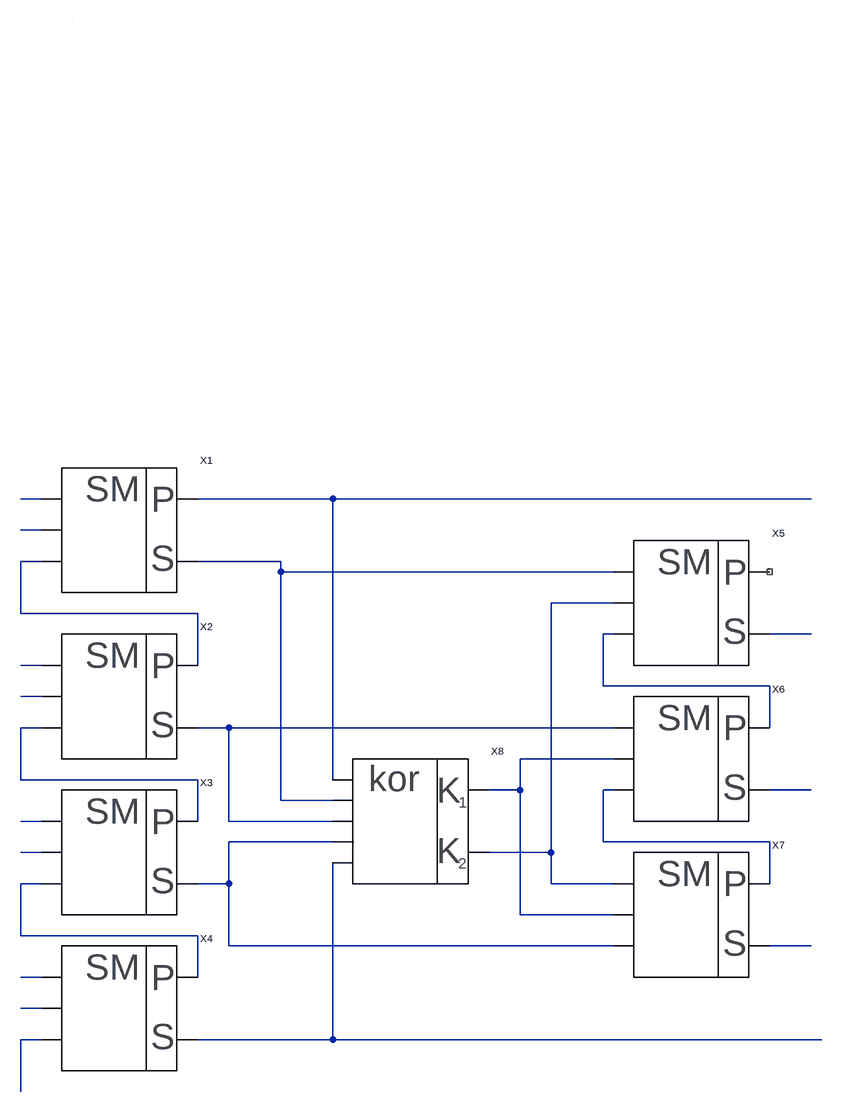
[diagram p0: schematic odnSum.asc]
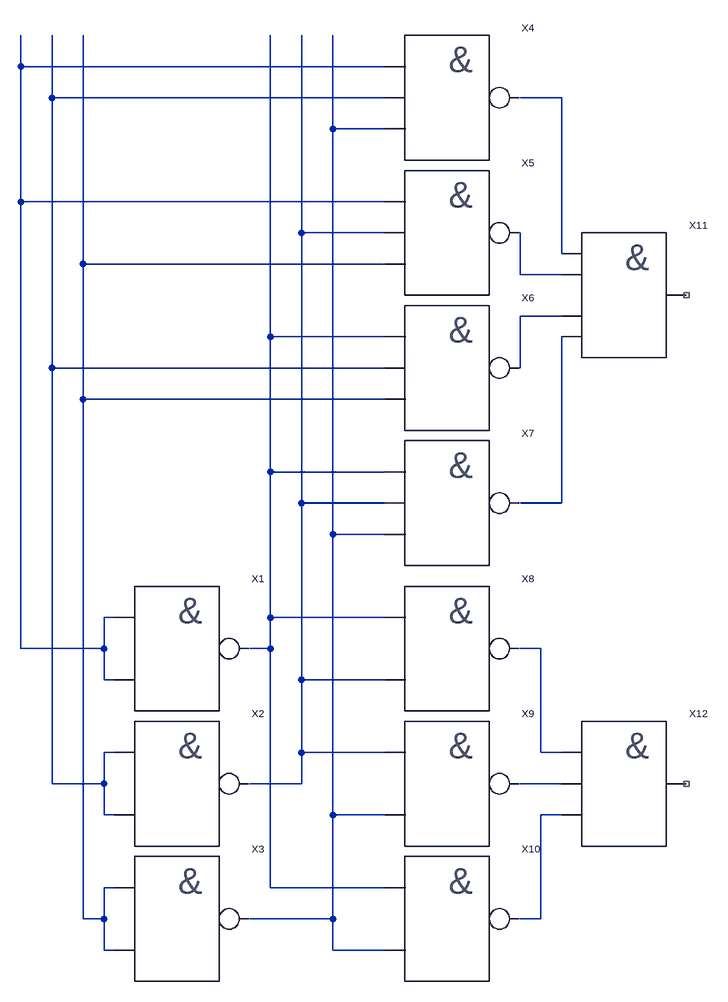
[diagram p1: sub-circuit odndvsum.asc]
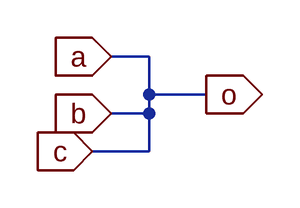
[diagram p2: sub-circuit and3.asc]
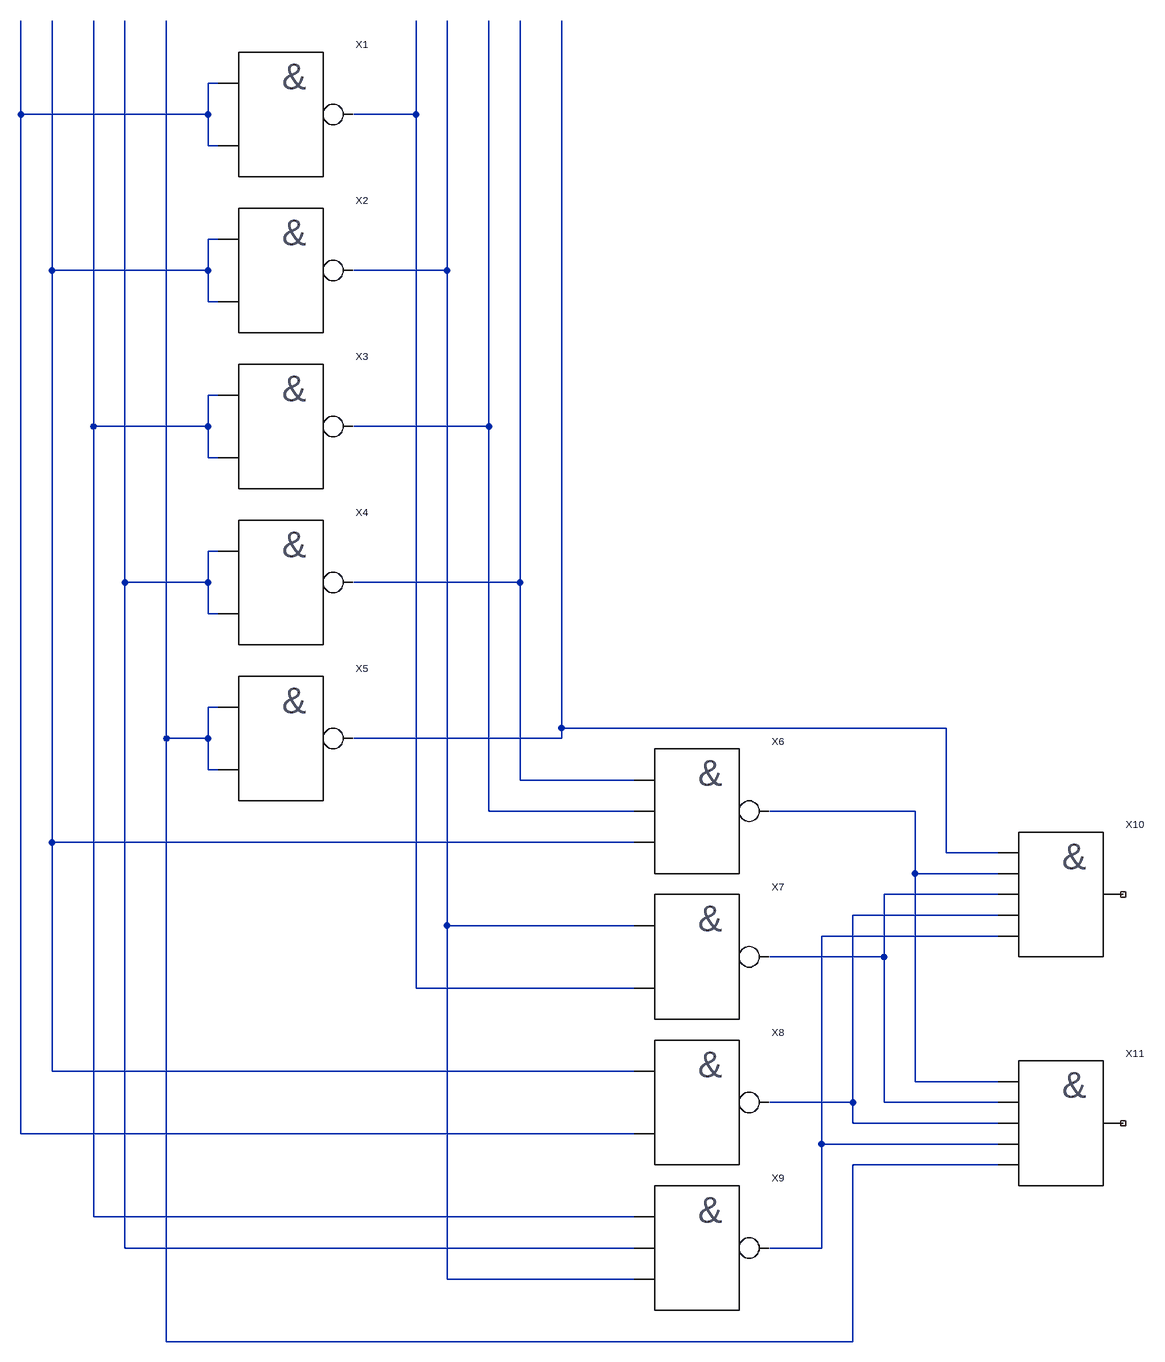
[diagram p3: sub-circuit korr.asc]
odnSum.asc, the LTspice schematic file:
Version 4
SHEET 1 1524 2164
WIRE -48 736 -80 736
WIRE 400 736 192 736
WIRE 1136 736 400 736
WIRE -48 784 -80 784
WIRE -48 832 -80 832
WIRE 320 832 192 832
WIRE 320 848 320 832
WIRE 832 848 320 848
WIRE 832 896 736 896
WIRE -80 912 -80 832
WIRE 192 912 -80 912
WIRE 832 944 816 944
WIRE 1136 944 1072 944
WIRE -48 992 -80 992
WIRE 192 992 192 912
WIRE 816 1024 816 944
WIRE 1072 1024 816 1024
WIRE -48 1040 -80 1040
WIRE -48 1088 -80 1088
WIRE 240 1088 192 1088
WIRE 832 1088 240 1088
WIRE 1072 1088 1072 1024
WIRE 832 1136 688 1136
WIRE -80 1168 -80 1088
WIRE 192 1168 -80 1168
WIRE 400 1168 400 736
WIRE 688 1184 688 1136
WIRE 688 1184 640 1184
WIRE 832 1184 816 1184
WIRE 1136 1184 1072 1184
WIRE 320 1200 320 848
WIRE 400 1200 320 1200
WIRE -48 1232 -80 1232
WIRE 192 1232 192 1168
WIRE 240 1232 240 1088
WIRE 400 1232 240 1232
WIRE 400 1264 240 1264
WIRE 816 1264 816 1184
WIRE 1072 1264 816 1264
WIRE -48 1280 -80 1280
WIRE 736 1280 736 896
WIRE 736 1280 640 1280
WIRE -48 1328 -80 1328
WIRE 240 1328 240 1264
WIRE 240 1328 192 1328
WIRE 736 1328 736 1280
WIRE 832 1328 736 1328
WIRE 1072 1328 1072 1264
WIRE 688 1376 688 1184
WIRE 832 1376 688 1376
WIRE -80 1408 -80 1328
WIRE 192 1408 -80 1408
WIRE 240 1424 240 1328
WIRE 832 1424 240 1424
WIRE 1136 1424 1072 1424
WIRE -48 1472 -80 1472
WIRE 192 1472 192 1408
WIRE -48 1520 -80 1520
WIRE -48 1568 -80 1568
WIRE 400 1568 400 1296
WIRE 400 1568 192 1568
WIRE 1152 1568 400 1568
WIRE -80 1648 -80 1568
WIRE 0 0 0 0
SYMBOL odnDvSum 48 784 R0
SYMATTR InstName X1
SYMBOL odnDvSum 48 1040 R0
SYMATTR InstName X2
SYMBOL odnDvSum 48 1520 R0
SYMATTR InstName X4
SYMBOL odnDvSum 928 896 R0
SYMATTR InstName X5
SYMBOL odnDvSum 928 1136 R0
SYMATTR InstName X6
SYMBOL odnDvSum 928 1376 R0
SYMATTR InstName X7
SYMBOL korr 496 1232 R0
SYMATTR InstName X8
SYMBOL odnDvSum 48 1280 R0
SYMATTR InstName X3

odndvsum.asc, the sub-circuit schematic file:
Version 4
SHEET 1 1032 2164
WIRE -16 752 -16 704
WIRE 544 752 -16 752
WIRE 32 800 32 704
WIRE 544 800 32 800
WIRE 816 800 752 800
WIRE 464 848 464 704
WIRE 544 848 464 848
WIRE -16 960 -16 752
WIRE 544 960 -16 960
WIRE 416 1008 416 704
WIRE 544 1008 416 1008
WIRE 816 1040 816 800
WIRE 80 1056 80 704
WIRE 544 1056 80 1056
WIRE 752 1072 752 1008
WIRE 816 1072 752 1072
WIRE 816 1136 752 1136
WIRE 368 1168 368 704
WIRE 544 1168 368 1168
WIRE 32 1216 32 800
WIRE 544 1216 32 1216
WIRE 752 1216 752 1136
WIRE 80 1264 80 1056
WIRE 544 1264 80 1264
WIRE 368 1376 368 1168
WIRE 544 1376 368 1376
WIRE 416 1424 416 1008
WIRE 544 1424 416 1424
WIRE 816 1424 816 1168
WIRE 816 1424 752 1424
WIRE 464 1472 464 848
WIRE 544 1472 464 1472
WIRE 128 1600 112 1600
WIRE 368 1600 368 1376
WIRE 544 1600 368 1600
WIRE -16 1648 -16 960
WIRE 112 1648 112 1600
WIRE 112 1648 -16 1648
WIRE 368 1648 368 1600
WIRE 368 1648 336 1648
WIRE 784 1648 752 1648
WIRE 112 1696 112 1648
WIRE 128 1696 112 1696
WIRE 416 1696 416 1424
WIRE 544 1696 416 1696
WIRE 128 1808 112 1808
WIRE 416 1808 416 1696
WIRE 544 1808 416 1808
WIRE 784 1808 784 1648
WIRE 816 1808 784 1808
WIRE 32 1856 32 1216
WIRE 112 1856 112 1808
WIRE 112 1856 32 1856
WIRE 416 1856 416 1808
WIRE 416 1856 336 1856
WIRE 816 1856 752 1856
WIRE 112 1904 112 1856
WIRE 128 1904 112 1904
WIRE 464 1904 464 1472
WIRE 544 1904 464 1904
WIRE 816 1904 784 1904
WIRE 128 2016 112 2016
WIRE 368 2016 368 1648
WIRE 544 2016 368 2016
WIRE 80 2064 80 1264
WIRE 112 2064 112 2016
WIRE 112 2064 80 2064
WIRE 464 2064 464 1904
WIRE 464 2064 336 2064
WIRE 784 2064 784 1904
WIRE 784 2064 752 2064
WIRE 112 2112 112 2064
WIRE 128 2112 112 2112
WIRE 464 2112 464 2064
WIRE 544 2112 464 2112
SYMBOL NAND2 224 1648 R0
SYMATTR InstName X1
SYMBOL NAND2 224 1856 R0
SYMATTR InstName X2
SYMBOL NAND2 224 2064 R0
SYMATTR InstName X3
SYMBOL NAND3 640 800 R0
SYMATTR InstName X4
SYMBOL NAND3 640 1008 R0
SYMATTR InstName X5
SYMBOL NAND3 640 1216 R0
SYMATTR InstName X6
SYMBOL NAND3 640 1424 R0
SYMATTR InstName X7
SYMBOL NAND2 640 1648 R0
SYMATTR InstName X8
SYMBOL NAND2 640 1856 R0
SYMATTR InstName X9
SYMBOL NAND2 640 2064 R0
SYMATTR InstName X10
SYMBOL AND4 912 1104 R0
SYMATTR InstName X11
SYMBOL AND3 912 1856 R0
SYMATTR InstName X12

and3.asc, the sub-circuit schematic file:
Version 4
SHEET 1 880 680
WIRE 96 80 64 80
WIRE 96 112 96 80
WIRE 144 112 96 112
WIRE 96 128 96 112
WIRE 96 128 64 128
WIRE 96 160 96 128
WIRE 96 160 48 160
FLAG 64 80 a
IOPIN 64 80 In
FLAG 64 128 b
IOPIN 64 128 In
FLAG 144 112 o
IOPIN 144 112 Out
FLAG 48 160 c
IOPIN 48 160 In

korr.asc, the sub-circuit schematic file:
Version 4
SHEET 1 1336 2548
WIRE -64 528 -80 528
WIRE -368 576 -368 432
WIRE -80 576 -80 528
WIRE -80 576 -368 576
WIRE 240 576 240 432
WIRE 240 576 144 576
WIRE -80 624 -80 576
WIRE -64 624 -80 624
WIRE -64 768 -80 768
WIRE -320 816 -320 432
WIRE -80 816 -80 768
WIRE -80 816 -320 816
WIRE 288 816 288 432
WIRE 288 816 144 816
WIRE -80 864 -80 816
WIRE -64 864 -80 864
WIRE -64 1008 -80 1008
WIRE -256 1056 -256 432
WIRE -80 1056 -80 1008
WIRE -80 1056 -256 1056
WIRE 352 1056 352 432
WIRE 352 1056 144 1056
WIRE -80 1104 -80 1056
WIRE -64 1104 -80 1104
WIRE -64 1248 -80 1248
WIRE -208 1296 -208 432
WIRE -80 1296 -80 1248
WIRE -80 1296 -208 1296
WIRE 400 1296 400 432
WIRE 400 1296 144 1296
WIRE -80 1344 -80 1296
WIRE -64 1344 -80 1344
WIRE -64 1488 -80 1488
WIRE 464 1520 464 432
WIRE 1056 1520 464 1520
WIRE -144 1536 -144 432
WIRE -80 1536 -80 1488
WIRE -80 1536 -144 1536
WIRE 464 1536 464 1520
WIRE 464 1536 144 1536
WIRE -80 1584 -80 1536
WIRE -64 1584 -80 1584
WIRE 400 1600 400 1296
WIRE 576 1600 400 1600
WIRE 352 1648 352 1056
WIRE 576 1648 352 1648
WIRE 1008 1648 784 1648
WIRE -320 1696 -320 816
WIRE 576 1696 -320 1696
WIRE 1056 1712 1056 1520
WIRE 1136 1712 1056 1712
WIRE 1008 1744 1008 1648
WIRE 1136 1744 1008 1744
WIRE 1136 1776 960 1776
WIRE 1136 1808 912 1808
WIRE 288 1824 288 816
WIRE 576 1824 288 1824
WIRE 1136 1840 864 1840
WIRE 960 1872 960 1776
WIRE 960 1872 784 1872
WIRE 240 1920 240 576
WIRE 576 1920 240 1920
WIRE -320 2048 -320 1696
WIRE 576 2048 -320 2048
WIRE 1008 2064 1008 1744
WIRE 1136 2064 1008 2064
WIRE 912 2096 912 1808
WIRE 912 2096 784 2096
WIRE 960 2096 960 1872
WIRE 1136 2096 960 2096
WIRE 912 2128 912 2096
WIRE 1136 2128 912 2128
WIRE -368 2144 -368 576
WIRE 576 2144 -368 2144
WIRE 864 2160 864 1840
WIRE 1136 2160 864 2160
WIRE 1136 2192 912 2192
WIRE -256 2272 -256 1056
WIRE 576 2272 -256 2272
WIRE -208 2320 -208 1296
WIRE 576 2320 -208 2320
WIRE 864 2320 864 2160
WIRE 864 2320 784 2320
WIRE 288 2368 288 1824
WIRE 576 2368 288 2368
WIRE -144 2464 -144 1536
WIRE 912 2464 912 2192
WIRE 912 2464 -144 2464
SYMBOL NAND2 32 576 R0
SYMATTR InstName X1
SYMBOL NAND2 32 816 R0
SYMATTR InstName X2
SYMBOL NAND2 32 1296 R0
SYMATTR InstName X4
SYMBOL NAND2 32 1536 R0
SYMATTR InstName X5
SYMBOL NAND3 672 1648 R0
SYMATTR InstName X6
SYMBOL NAND2 672 1872 R0
SYMATTR InstName X7
SYMBOL NAND2 672 2096 R0
SYMATTR InstName X8
SYMBOL NAND3 672 2320 R0
SYMATTR InstName X9
SYMBOL AND5 1232 1776 R0
SYMATTR InstName X10
SYMBOL AND5 1232 2128 R0
SYMATTR InstName X11
SYMBOL NAND2 32 1056 R0
SYMATTR InstName X3

The netlist it stands for:
* odnSum.asc
XX1 N001 N003 N004 N002 N005 odndvsum
XX2 N009 N010 N011 N004 N012 odndvsum
XX4 N021 N022 N023 N019 N024 odndvsum
XX5 N005 N006 N007 NC_01 N008 odndvsum
XX6 N012 N013 N014 N007 N015 odndvsum
XX7 N006 N013 N017 N014 N020 odndvsum
XX8 N002 N005 N012 N017 N024 N013 N006 korr
XX3 N016 N018 N019 N011 N017 odndvsum

* block symbol definitions
.subckt odndvsum a b c S M
XX1 N001 N001 N009 NAND2  ; pins a b o
XX2 N002 N002 N005 NAND2  ; pins a b o
XX3 N006 N006 N004 NAND2  ; pins a b o
XX4 N001 N004 N003 N002 NAND3  ; pins a b o c
XX5 N001 N006 N007 N005 NAND3  ; pins a b o c
XX6 N009 N006 N008 N002 NAND3  ; pins a b o c
XX7 N009 N004 N010 N005 NAND3  ; pins a b o c
XX8 N009 N005 N011 NAND2  ; pins a b o
XX9 N005 N004 N012 NAND2  ; pins a b o
XX10 N009 N004 N013 NAND2  ; pins a b o
XX11 N003 N010 NC_01 N007 N008 AND4  ; pins a b o c d
XX12 N011 N013 NC_02 N012 and3
.ends odndvsum

.subckt and3 a b o c
.ends and3

.subckt korr q1 q2 q3 q4 p k1 k2
XX1 N001 N001 N002 NAND2  ; pins a b o
XX2 N003 N003 N004 NAND2  ; pins a b o
XX4 N007 N007 N008 NAND2  ; pins a b o
XX5 N009 N009 N010 NAND2  ; pins a b o
XX6 N008 N003 N011 N006 NAND3  ; pins a b o c
XX7 N004 N002 N012 NAND2  ; pins a b o
XX8 N003 N001 N013 NAND2  ; pins a b o
XX9 N005 N004 N014 N007 NAND3  ; pins a b o c
XX10 N010 N014 NC_01 N011 N013 N012 AND5  ; pins a b o c d e
XX11 N011 N009 NC_02 N012 N014 N013 AND5  ; pins a b o c d e
XX3 N005 N005 N006 NAND2  ; pins a b o
.ends korr

.backanno
.end